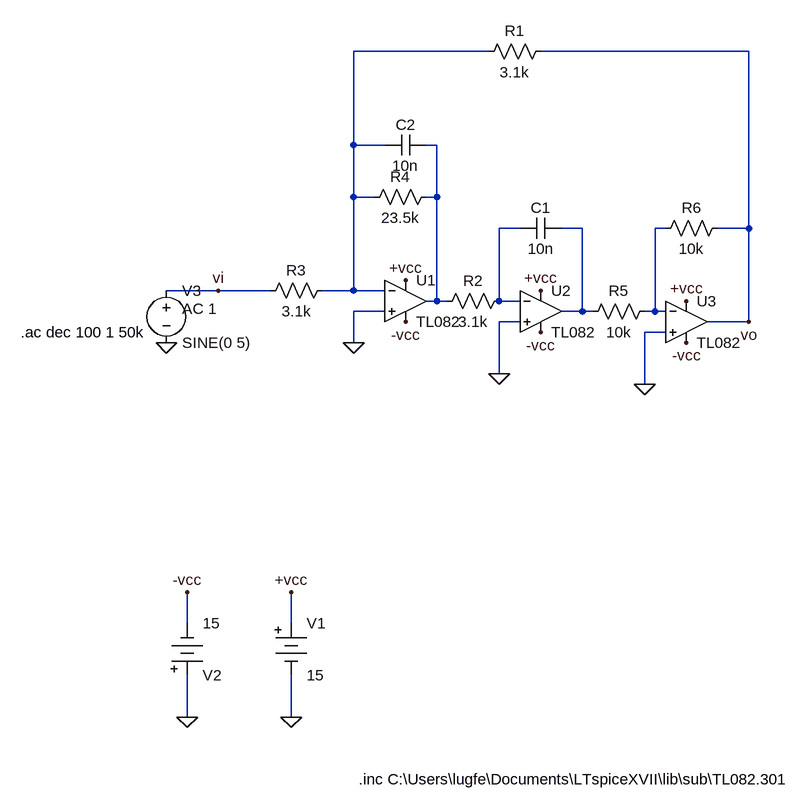
[diagram p0: schematic tow thomas.asc]
tow thomas.asc, the LTspice schematic file:
Version 4
SHEET 1 880 688
WIRE 128 -448 -80 -448
WIRE 528 -448 208 -448
WIRE -80 -304 -80 -448
WIRE -32 -304 -80 -304
WIRE 48 -304 32 -304
WIRE -80 -224 -80 -304
WIRE -48 -224 -80 -224
WIRE 48 -224 48 -304
WIRE 48 -224 32 -224
WIRE 176 -176 144 -176
WIRE 272 -176 240 -176
WIRE 400 -176 384 -176
WIRE 528 -176 528 -448
WIRE 528 -176 480 -176
WIRE -288 -80 -368 -80
WIRE -208 -80 -288 -80
WIRE -80 -80 -80 -224
WIRE -80 -80 -128 -80
WIRE -32 -80 -80 -80
WIRE 48 -64 48 -224
WIRE 48 -64 32 -64
WIRE 64 -64 48 -64
WIRE 144 -64 144 -176
WIRE 176 -64 144 -64
WIRE -32 -48 -80 -48
WIRE 272 -48 272 -176
WIRE 272 -48 240 -48
WIRE 288 -48 272 -48
WIRE 384 -48 384 -176
WIRE 384 -48 368 -48
WIRE 400 -48 384 -48
WIRE 176 -32 144 -32
WIRE 528 -32 528 -176
WIRE 528 -32 464 -32
WIRE 400 -16 368 -16
WIRE -80 0 -80 -48
WIRE 144 48 144 -32
WIRE 368 64 368 -16
WIRE -336 432 -336 384
WIRE -176 432 -176 384
WIRE -336 576 -336 512
WIRE -176 576 -176 512
FLAG -176 384 +vcc
FLAG -176 576 0
FLAG -336 384 -vcc
FLAG -336 576 0
FLAG -368 0 0
FLAG 0 -32 -vcc
FLAG 0 -96 +vcc
FLAG -80 0 0
FLAG 144 48 0
FLAG 368 64 0
FLAG 528 -32 vo
FLAG 208 -80 +vcc
FLAG 432 -64 +vcc
FLAG 208 -16 -vcc
FLAG 432 0 -vcc
FLAG -288 -80 vi
SYMBOL Misc\\battery -176 416 R0
WINDOW 123 0 0 Left 0
WINDOW 39 0 0 Left 0
SYMATTR InstName V1
SYMATTR Value 15
SYMBOL Misc\\battery -336 528 M180
WINDOW 123 0 0 Left 0
WINDOW 39 0 0 Left 0
SYMATTR InstName V2
SYMATTR Value 15
SYMBOL Opamps\\opamp2 0 -128 R0
SYMATTR InstName U1
SYMATTR Value TL082
SYMBOL voltage -368 -96 R0
WINDOW 123 24 44 Left 2
WINDOW 39 0 0 Left 0
SYMATTR Value2 AC 1
SYMATTR InstName V3
SYMATTR Value SINE(0 5)
SYMBOL Opamps\\opamp2 208 -112 R0
SYMATTR InstName U2
SYMATTR Value TL082
SYMBOL Opamps\\opamp2 432 -96 R0
SYMATTR InstName U3
SYMATTR Value TL082
SYMBOL res 224 -464 R90
WINDOW 0 0 56 VBottom 2
WINDOW 3 32 56 VTop 2
SYMATTR InstName R1
SYMATTR Value 3.1k
SYMBOL res 160 -80 R90
WINDOW 0 0 56 VBottom 2
WINDOW 3 32 56 VTop 2
SYMATTR InstName R2
SYMATTR Value 3.1k
SYMBOL res -112 -96 R90
WINDOW 0 0 56 VBottom 2
WINDOW 3 32 56 VTop 2
SYMATTR InstName R3
SYMATTR Value 3.1k
SYMBOL res 48 -240 R90
WINDOW 0 0 56 VBottom 2
WINDOW 3 32 56 VTop 2
SYMATTR InstName R4
SYMATTR Value 23.5k
SYMBOL res 384 -64 R90
WINDOW 0 0 56 VBottom 2
WINDOW 3 32 56 VTop 2
SYMATTR InstName R5
SYMATTR Value 10k
SYMBOL res 496 -192 R90
WINDOW 0 0 56 VBottom 2
WINDOW 3 32 56 VTop 2
SYMATTR InstName R6
SYMATTR Value 10k
SYMBOL cap 240 -192 R90
WINDOW 0 0 32 VBottom 2
WINDOW 3 32 32 VTop 2
SYMATTR InstName C1
SYMATTR Value 10n
SYMBOL cap 32 -320 R90
WINDOW 0 0 32 VBottom 2
WINDOW 3 32 32 VTop 2
SYMATTR InstName C2
SYMATTR Value 10n
TEXT -72 672 Left 2 !.inc C:\\Users\\lugfe\\Documents\\LTspiceXVII\\lib\\sub\\TL082.301
TEXT -592 -16 Left 2 !.ac dec 100 1 50k

The netlist it stands for:
* tow thomas.asc
V1 +vcc 0 15
V2 0 -vcc 15
XU1 0 N001 +vcc -vcc N002 TL082  ; pins In+ In- V+ V- OUT
V3 vi 0 SINE(0 5) AC 1
XU2 0 N003 +vcc -vcc N004 TL082  ; pins In+ In- V+ V- OUT
XU3 0 N005 +vcc -vcc vo TL082  ; pins In+ In- V+ V- OUT
R1 vo N001 3.1k
R2 N003 N002 3.1k
R3 N001 vi 3.1k
R4 N002 N001 23.5k
R5 N005 N004 10k
R6 vo N005 10k
C1 N004 N003 10n
C2 N002 N001 10n
.inc C:\Users\lugfe\Documents\LTspiceXVII\lib\sub\TL082.301
.ac dec 100 1 50k
.backanno
.end